# Altium schematic sheet 3_adcs_circuits.schdoc: Power Circuits
size A4; Engineer: Eng_2_ALT; SheetNumber: 3; SheetTotal: 3; Designed by: André M. P. Mattos; Version: v0.1
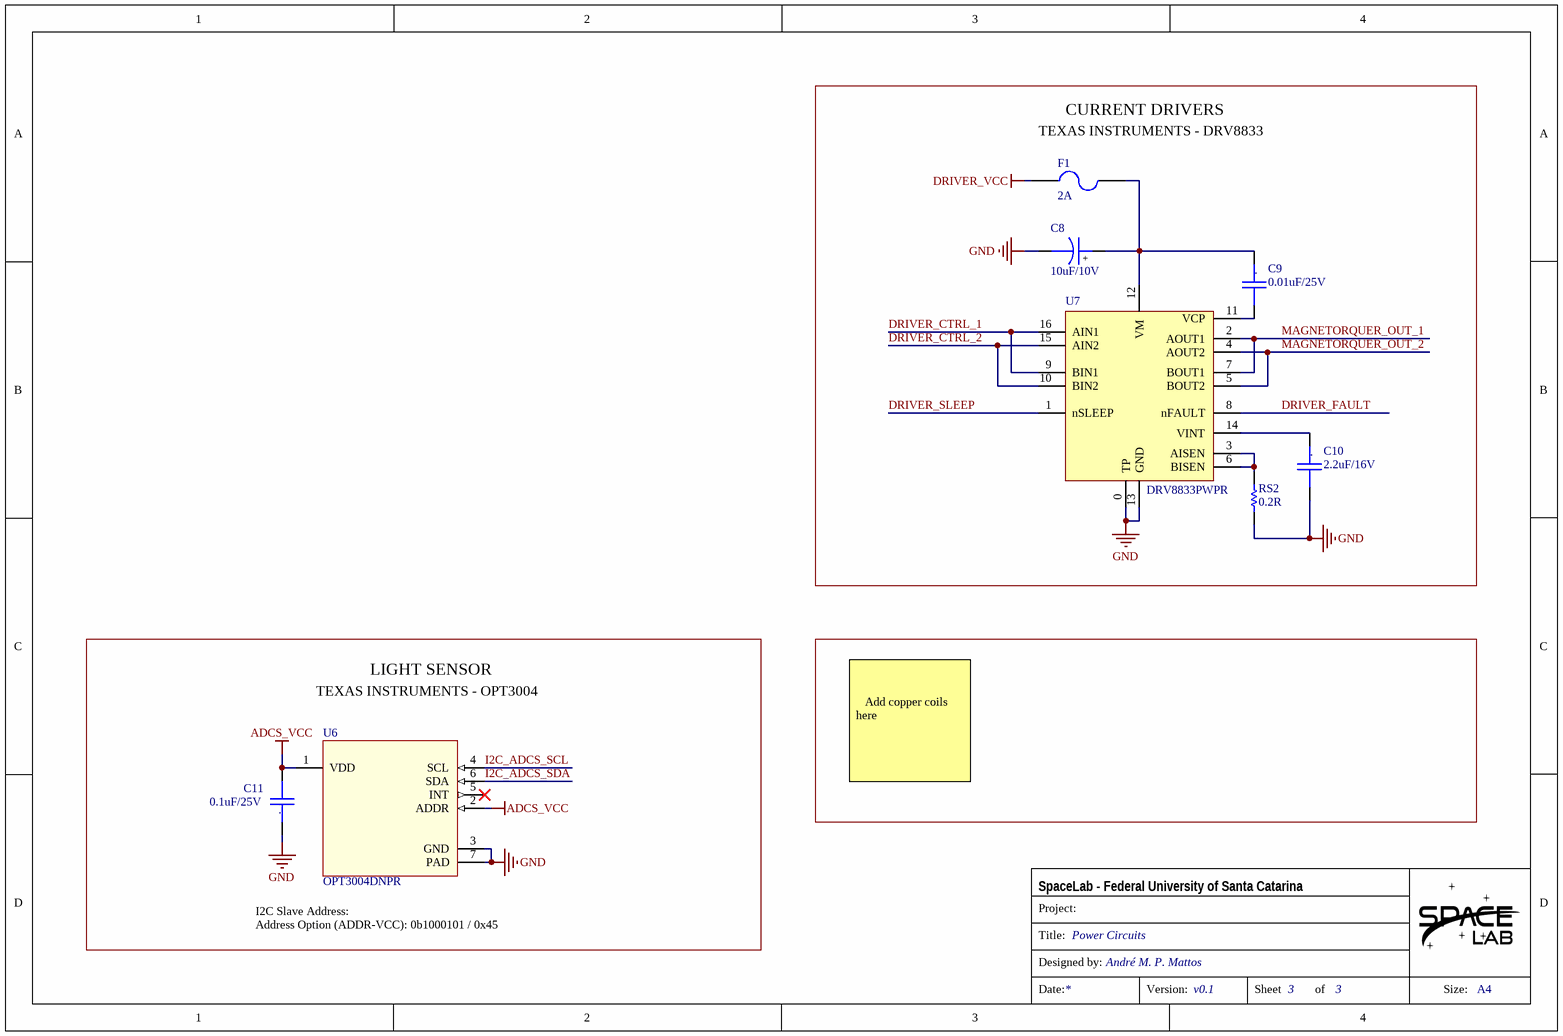
[diagram p0: 3_adcs_circuits.schdoc]

## Parts
C8  10uF/10V  [CC0805_Tantalum]
C9  0.01uF/25V  [CC0805]
C10  2.2uF/16V  [CC0805]
C11  0.1uF/25V  [CC0805]
F1  2A  [1206]
RS2  0.2R  [0805]
U6  OPT3004DNPR  [DNP0006A]
U7  DRV8833PWPR  [16TTSSOP]

## Blocks framed on the sheet
CURRENT DRIVERS: C8-C10 F1 RS2 U7
LIGHT SENSOR: C11 U6

## Nets
ADCS_VCC: C11.2 U6.1(VDD) U6.2(ADDR)
DRIVER_VCC: F1.2
GND: C8.2 C10.2 C11.1 RS2.1 U6.3(GND) U6.7(PAD) U7.0(TP) U7.13(GND)
DRIVER_CTRL_1: U7.9(BIN1) U7.16(AIN1)
DRIVER_CTRL_2: U7.10(BIN2) U7.15(AIN2)
DRIVER_FAULT: U7.8(nFAULT)
DRIVER_SLEEP: U7.1(nSLEEP)
I2C_ADCS_SCL: U6.4(SCL)
I2C_ADCS_SDA: U6.6(SDA)
MAGNETORQUER_OUT_1: U7.2(AOUT1) U7.7(BOUT1)
MAGNETORQUER_OUT_2: U7.4(AOUT2) U7.5(BOUT2)
NetC8_1: C8.1 C9.1 F1.1 U7.12(VM)
NetC9_2: C9.2 U7.11(VCP)
NetC10_1: C10.1 U7.14(VINT)
NetRS2_2: RS2.2 U7.3(AISEN) U7.6(BISEN)

Not connected (* = marked no-connect by the designer): U6 5(INT)*

## Notes on the sheet
- (near F1) TEXAS INSTRUMENTS - DRV8833
- TEXAS INSTRUMENTS - OPT3004
- Add copper coils here
- (near U6) I2C Slave Address:
  Address Option (ADDR-VCC): 0b1000101 / 0x45
- Project:
- SpaceLab - Federal University of Santa Catarina
- Title:
- Designed by:
- Date:
- Version:
- Sheet
- of
- Size:
- A4
- (in symbol Cap_Cer_X7R_0.1uF_25V_0805) .
- (in symbol Cap_Cer_X7R_0.01uF_50V_0805) .
- (in symbol Cap_Cer_X7R_2.2uF_16V_0805) .
- (in symbol Cap_Tant_SMD_10uF_10V_0805) +

## Library data of the parts
C8 = Cap_Tant_SMD_10uF_10V_0805: CAP Tantalum 10uF 10V 20% 0805; Partnumber: TPSP106M010R2000; NCM: 8532.21.11
C9 = Cap_Cer_X7R_0.01uF_50V_0805: CAP CER 0.01uF 25V 10% X7R 0805; Partnumber: CL21B103KAANNNC; NCM: 8532.24.10
C10 = Cap_Cer_X7R_2.2uF_16V_0805: CAP CER 2.2uF 16V 10% X7R 0805; Partnumber: EMF212B7225KGHT
C11 = Cap_Cer_X7R_0.1uF_25V_0805: CAP CER 0.1UF 25V 10% X7R 0805; Partnumber: CC0805KRX7R8BB104; NCM: 8532.24.10
F1 = Fuse: Surface Mount Fuses SMD 1206 Fast Action 2A; PartNumber: SF-1206FP200-2
RS2 = R0.2_1%_1/4W_0805: RES 0.2R OHM 1/4W 1% 0805; Partnumber: ERJ-U6SFR20V; NCM: 8533.21.20
U6 = OPT3004DNPR: No Description Available; Manufacturer: Texas Instruments; PartNumber: OPT3004DNPR; RefDes: RefDes; Type: DEV; Value: Value; Copyright: Copyright (C) 2018 Accelerated Designs. All rights reserved
U7 = DRV8833PWPR: Partnumber: DRV8833PWPR